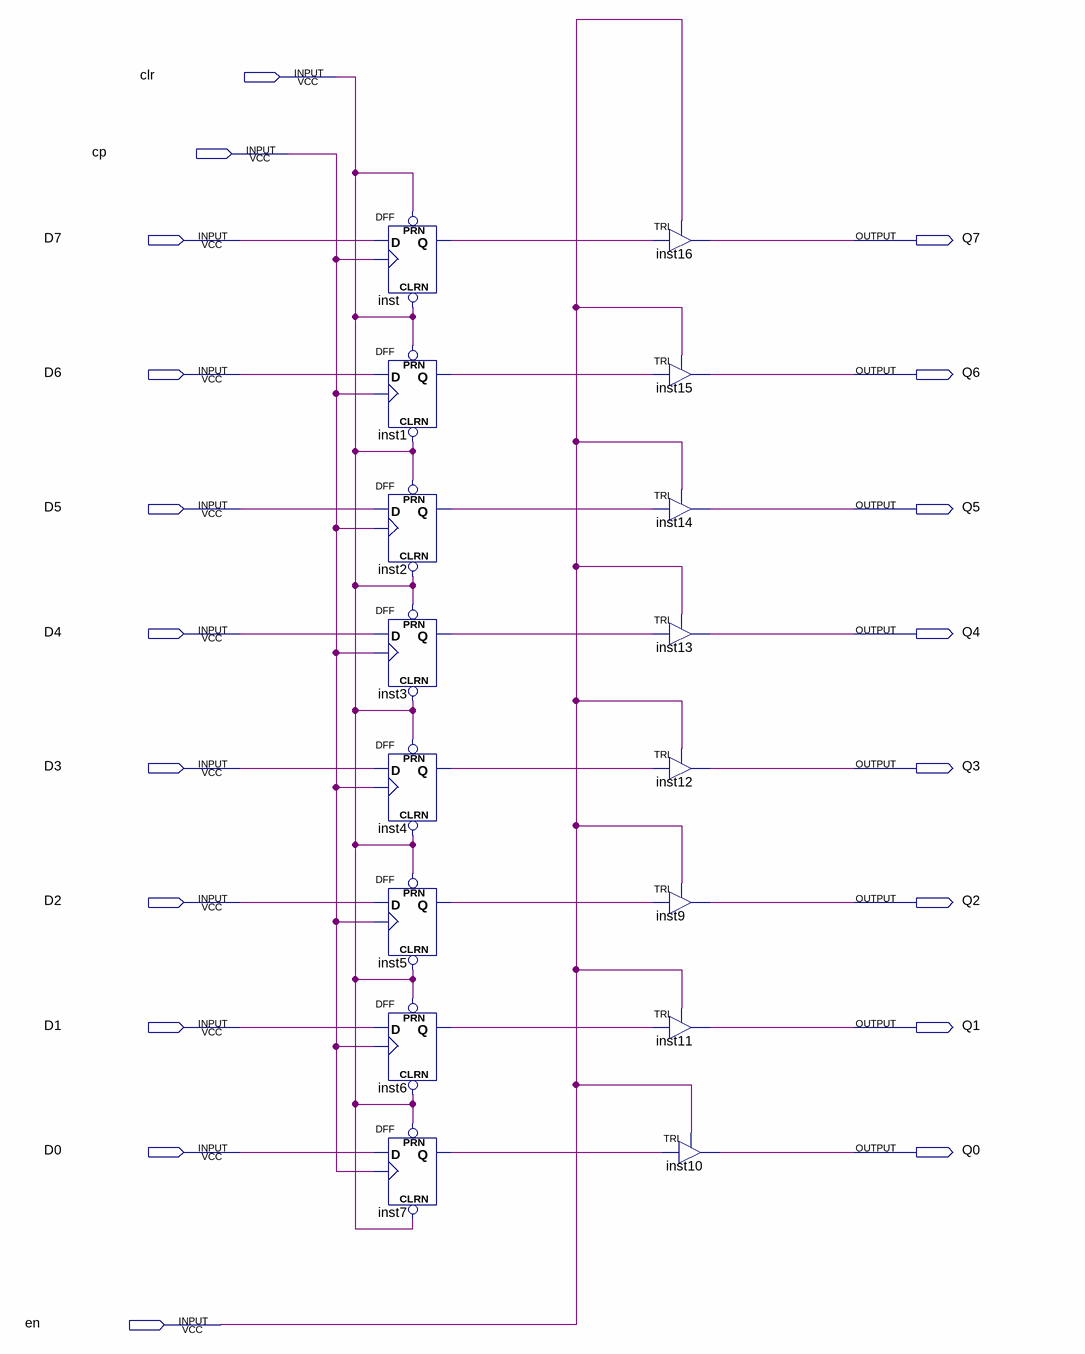
[diagram p0: schematic sheet]
// Quartus schematic register---8.bdf as structural Verilog: 16 symbols, 19 pins
module \register---8  (
  input  clr,
  input  cp,
  input  D7,
  input  D6,
  input  D5,
  input  D4,
  input  D3,
  input  D2,
  input  D1,
  input  D0,
  input  en,
  output Q7,
  output Q6,
  output Q5,
  output Q4,
  output Q3,
  output Q2,
  output Q1,
  output Q0
);

  wire inst1_q, inst2_q, inst3_q, inst4_q, inst5_q, inst6_q, inst7_q, inst_q;

  DFF inst (.CLRN(clr), .CLK(cp), .D(D7), .PRN(clr), .Q(inst_q));
  DFF inst1 (.CLRN(clr), .CLK(cp), .D(D6), .PRN(clr), .Q(inst1_q));
  DFF inst2 (.CLRN(clr), .CLK(cp), .D(D5), .PRN(clr), .Q(inst2_q));
  DFF inst3 (.CLRN(clr), .CLK(cp), .D(D4), .PRN(clr), .Q(inst3_q));
  DFF inst4 (.CLRN(clr), .CLK(cp), .D(D3), .PRN(clr), .Q(inst4_q));
  DFF inst5 (.CLRN(clr), .CLK(cp), .D(D2), .PRN(clr), .Q(inst5_q));
  DFF inst6 (.CLRN(clr), .CLK(cp), .D(D1), .PRN(clr), .Q(inst6_q));
  DFF inst7 (.CLRN(clr), .CLK(cp), .D(D0), .PRN(clr), .Q(inst7_q));
  TRI inst16 (.IN(inst_q), .OE(en), .OUT(Q7));
  TRI inst15 (.IN(inst1_q), .OE(en), .OUT(Q6));
  TRI inst14 (.IN(inst2_q), .OE(en), .OUT(Q5));
  TRI inst13 (.IN(inst3_q), .OE(en), .OUT(Q4));
  TRI inst12 (.IN(inst4_q), .OE(en), .OUT(Q3));
  TRI inst9 (.IN(inst5_q), .OE(en), .OUT(Q2));
  TRI inst11 (.IN(inst6_q), .OE(en), .OUT(Q1));
  TRI inst10 (.IN(inst7_q), .OE(en), .OUT(Q0));
endmodule
